# EAGLE design cap_sensor (EAGLE 7.7.0)
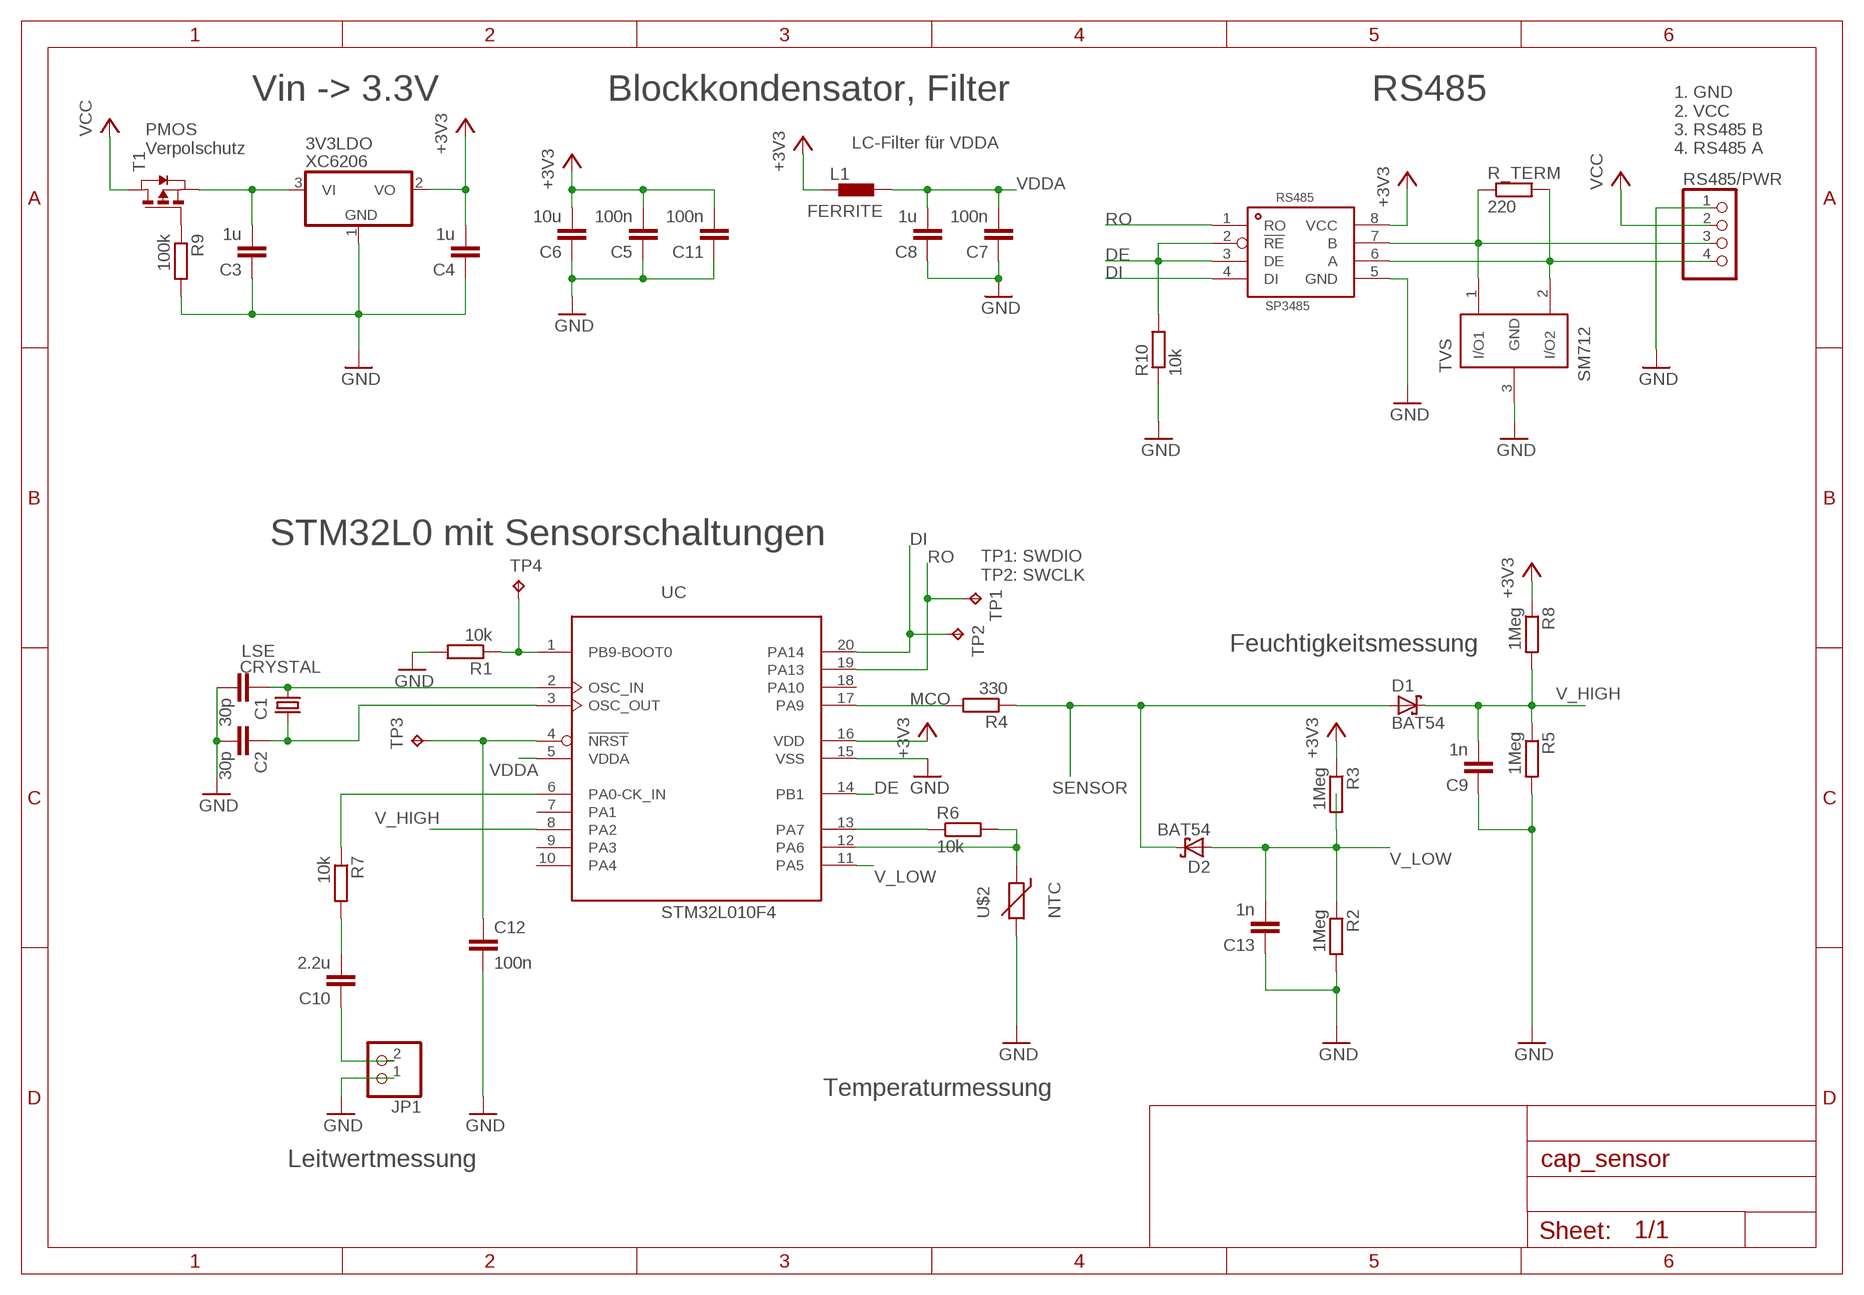
[diagram p0: schematic, sheet 1]

## Parts
3V3LDO  XC6206  [SOT23-3]
C1  30p  C-EUC0603  [C0603]
C2  30p  C-EUC0603  [C0603]
C3  1u  C-EUC0603  [C0603]
C4  1u  C-EUC0603  [C0603]
C5  100n  C-EUC0603  [C0603]
C6  10u  C-EUC0603  [C0603]
C7  100n  C-EUC0603  [C0603]
C8  1u  C-EUC0603  [C0603]
C9  1n  C-EUC0603  [C0603]
C10  2.2u  C-EUC0603  [C0603]
C11  100n  C-EUC0603  [C0603]
C12  100n  C-EUC0603  [C0603]
C13  1n  C-EUC0603  [C0603]
D1  BAT54  [SOT23]
D2  BAT54  [SOT23]
JP1  PINHD-1X2  [1X02]
L1  FERRITE  [R0603]
LSE  CRYSTAL  [CRYSTAL-3.2X1.5]
R1  10k  R-EU_R0603  [R0603]
R2  1Meg  R-EU_R0603  [R0603]
R3  1Meg  R-EU_R0603  [R0603]
R4  330  R-EU_R0603  [R0603]
R5  1Meg  R-EU_R0603  [R0603]
R6  10k  R-EU_R0603  [R0603]
R7  10k  R-EU_R0603  [R0603]
R8  1Meg  R-EU_R0603  [R0603]
R9  100k  R-EU_R0603  [R0603]
R10  10k  R-EU_R0603  [R0603]
R_TERM  220  R-EU_R0603  [R0603]
RS485  SP3485  [NSOIC8]
RS485/PWR  PINHD-1X4  [1X04]
T1  PMOSSOT23  [SOT-23]
TP1  TPTP12R  [TP12R]
TP2  TPTP12R  [TP12R]
TP3  TPTP12R  [TP12R]
TP4  TPTP12R  [TP12R]
TVS  SM712  [SOT23-3]
U$2  NTC  [R0603]
UC  STM32L010F4  [TSSOP20-I]

## Nets
+3V3: 3V3LDO.2(VO) C4.2 C5.2 C6.2 C11.2 L1.1 R3.1 R8.1 RS485.8(VCC) UC.16(VDD)
DE: R10.2 RS485.2(!RE) RS485.3(DE) UC.14(PB1)
DI: RS485.4(DI) TP2.TP UC.20(PA14)
GND: 3V3LDO.1(GND) C1.2 C2.2 C3.1 C4.1 C5.1 C6.1 C7.1 C8.1 C9.1 C11.1 C12.2 C13.1 JP1.1 R1.2 R2.2 R5.2 R9.2 R10.1 RS485.5(GND) RS485/PWR.1 TVS.3(GND) U$2.2 UC.15(VSS)
MCO: R4.2 UC.17(PA9)
N$1: 3V3LDO.3(VI) C3.2 T1.2(S)
N$2: R1.1 TP4.TP UC.1(PB9-BOOT0)
N$3: R6.1 UC.13(PA7)
N$4: C10.1 JP1.2
N$5: C10.2 R7.2
N$6: R6.2 U$2.1 UC.12(PA6)
N$7: C12.1 TP3.TP UC.4(!NRST)
N$8: C1.1 LSE.1 UC.2(OSC_IN)
N$9: C2.1 LSE.2 UC.3(OSC_OUT)
N$10: R9.1 T1.3(G)
N$14: R_TERM.1 RS485.7(B) RS485/PWR.3 TVS.1(I/O1)
N$15: R_TERM.2 RS485.6(A) RS485/PWR.4 TVS.2(I/O2)
RO: RS485.1(RO) TP1.TP UC.19(PA13)
SENS_RES: R7.1 UC.6(PA0-CK_IN)
SENSOR: D1.1(A) D2.3(C) R4.1
V_HIGH: C9.2 D1.3(C) R5.1 R8.2 UC.8(PA2)
V_LOW: C13.2 D2.1(A) R2.1 R3.2 UC.11(PA5)
VCC: RS485/PWR.2 T1.1(D)
VDDA: C7.2 C8.2 L1.2 UC.5(VDDA)
Unconnected: UC.7(PA1) UC.9(PA3) UC.10(PA4) UC.18(PA10)

## Notes on the sheet
- Vin -> 3.3V | Blockkondensator, Filter | RS485
- LC-Filter für VDDA
- PMOS
  Verpolschutz
- 1. GND
  2. VCC
  3. RS485 B
  4. RS485 A
- STM32L0 mit Sensorschaltungen
- TP1: SWDIO
  TP2: SWCLK
- Feuchtigkeitsmessung
- Temperaturmessung
- Leitwertmessung

## Library data of the parts
3V3LDO = misc:XC6206
C1-C13 = rcl:C-EU: CAPACITOR, European symbol
D1 D2 = diode:BAT54: Schottky Diodes Source: Fairchild .. BAT54.pdf
JP1 = pinhead:PINHD-1X2: PIN HEADER
L1 = misc:FERRITE
LSE = misc:CRYSTAL
R1-R10 R_TERM = rcl:R-EU_: RESISTOR, European symbol
RS485 = misc:SP3485
RS485/PWR = pinhead:PINHD-1X4: PIN HEADER
T1 = zetex:PMOSSOT23: MOS FET; OC_FARNELL: unknown; OC_NEWARK: unknown
TP1-TP4 = testpad:TP: Test pad
TVS = misc:SM712
U$2 = misc:NTC
UC = micro-stm_v3:STM32L010F4

## Board
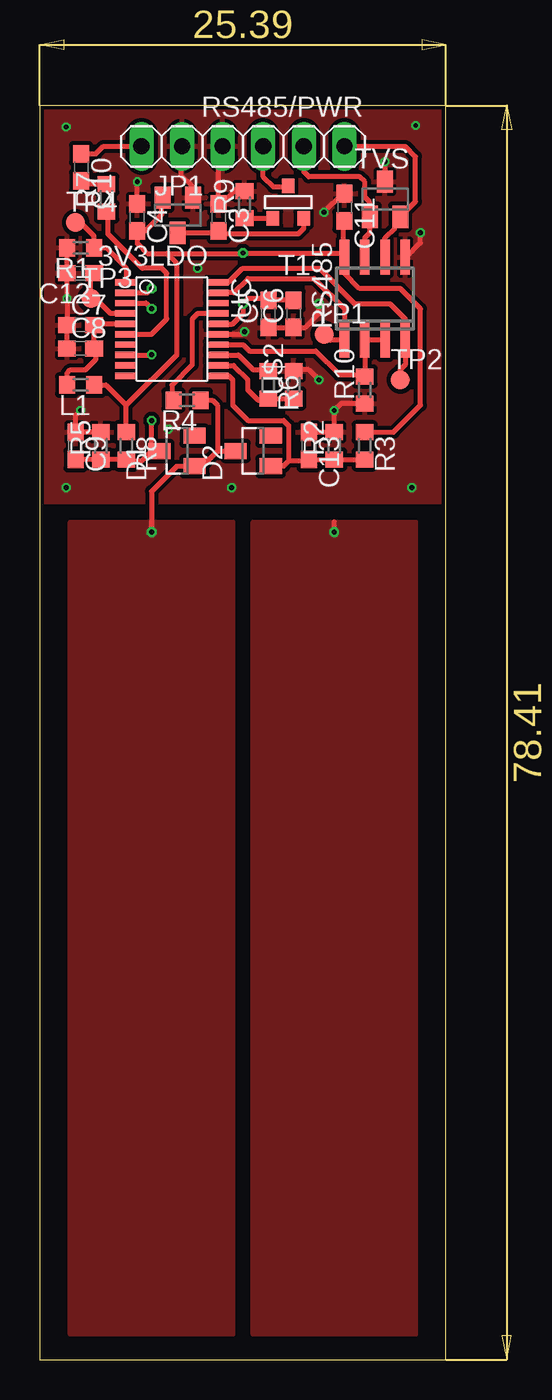
[diagram p1: board, top side]
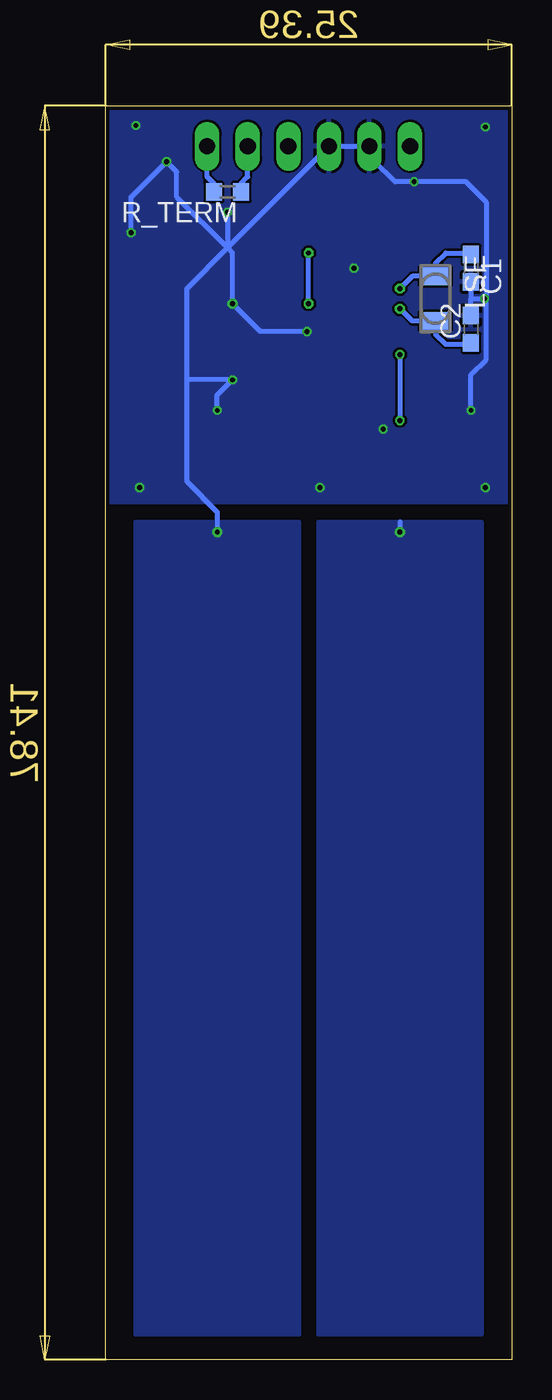
[diagram p2: board, bottom side, seen from below]

Size 25.39 x 78.41 mm. Coordinates in mm from the lower left corner, seen from the top.
Outline: 0,78.41 0,0 25.39,0 25.39,78.41 0,78.41
Copper layers (1*16): Top 0.018mm / dielectric 1.55mm / Bottom 0.018mm
Design rules "eC_2Layer_PClass6_BaseCopperO18_eCDefault": minimum track width 0.15mm, minimum drill 0.35mm, track to track 0.15mm, track to pad 0.15mm, pad to pad 0.15mm, via to via 0.15mm, smd to smd 0mil, copper to edge 0.25mm, drill to drill 0.35mm, minimum pad ring 0.175mm, minimum via ring 0.125mm, stop-mask expansion 0mil, vias tented up to drill 0.45mm, thermal gap 0.2mm

### Footprints (pad centres in the part's own frame; a part is rotated, then mirrored left to right if it is on the bottom)
SOT23-3 = smd 1 x 1.4: 1 -0.95,-0.6; 2 0.95,-0.6; 3 0,1.6
C0603 = smd 1.1 x 1: 1 -0.85,0; 2 0.85,0
SOT23 = smd 1 x 1.4: 1 -0.95,-1.1; 2 0.95,-1.1; 3 0,1.1
1X02 = drill 1.016 long: 1 -1.27,0; 2 1.27,0
R0603 = smd 1 x 1.1: 1 -0.85,0; 2 0.85,0
CRYSTAL-3.2X1.5 = smd 1.1 x 1.9: 1 -1.4,0; 2 1.4,0
NSOIC8 = smd 0.6 x 2.2: 1 -1.905,-2.6; 2 -0.635,-2.6; 3 0.635,-2.6; 4 1.905,-2.6; 5 1.905,2.6; 6 0.635,2.6; 7 -0.635,2.6; 8 -1.905,2.6
1X04 = drill 1.016 long: 1 -3.81,0; 2 -1.27,0; 3 1.27,0; 4 3.81,0
SOT-23 = smd 0.787 x 0.889: 1 0.025,-1.016; 2 -0.94,1.016; 3 0.991,1.016
TP12R = smd 1.2 x 1.2: TP 0,0
TSSOP20-I = smd 0.4 x 1.35: 1 -2.925,-2.875; 2 -2.275,-2.875; 3 -1.625,-2.875; 4 -0.975,-2.875; 5 -0.325,-2.875; 6 0.325,-2.875; 7 0.975,-2.875; 8 1.625,-2.875; 9 2.275,-2.875; 10 2.925,-2.875; 11 2.925,2.875; 12 2.275,2.875; 13 1.625,2.875; 14 0.975,2.875; 15 0.325,2.875; 16 -0.325,2.875; 17 -0.975,2.875; 18 -1.625,2.875; 19 -2.275,2.875; 20 -2.925,2.875

### Placement (x,y rotation side)
3V3LDO  8.62,72.06 180 top
C1  2.54,68.25 270 bottom
C2  2.54,64.44 90 bottom
C3  11.18,71.42 270 top
C4  6.07,71.42 270 top
C5  14.29,65.39 90 top
C6  15.88,65.39 90 top
C7  2.54,64.69 0 top
C8  2.54,63.23 0 top
C9  2.22,57.14 270 top
C10  2.58,74.55 270 top
C11  19.05,72.06 270 top
C12  2.54,67.93 180 top
C13  16.83,57.14 270 top
D1  8.57,56.82 90 top
D2  13.34,56.82 90 top
JP1  7.62,75.87 180 top
L1  2.54,60.95 180 top
LSE  4.76,66.34 270 bottom
R1  2.54,69.52 180 top
R2  18.41,57.14 90 top
R3  20.32,57.14 270 top
R4  9.21,60 180 top
R5  3.81,57.14 90 top
R6  14.29,60.95 270 top
R7  4.17,72.64 90 top
R8  5.4,57.14 270 top
R9  12.8,72.21 90 top
R10  20.32,60.63 90 top
R_TERM  17.78,73.01 180 bottom
RS485  20.95,66.34 0 top
RS485/PWR  15.24,75.87 0 top
T1  15.56,72.38 180 top
TP1  17.78,64.12 0 top
TP2  22.54,61.27 0 top
TP3  3.17,66.34 0 top
TP4  2.22,71.11 0 top
TVS  21.59,72.06 0 top
U$2  15.88,60.95 90 top
UC  8.26,64.44 270 top

### Tracks (layer width: path | path; a pad name or v marks a point on that pad's centre or on a via)
+3V3  (via drill 0.3 pad 0.61)
  Top 0.305: 5.4,59.68 8.57,62.85 8.57,68.52 7.92,69.16 | 13.97,66.34 14.19,66.34 C5.2 C6.2 | 14.07,66.24 13.97,66.34 | 13.97,66.34 13.02,66.34 v12.7,66.03 12.7,65.41 12.06,64.77 UC.16 | R8.1 5.4,59.68 | L1.1 4.13,60.95 5.4,59.68 | RS485.8 19.05,67.93 20,66.98 22.54,66.98 23.81,65.71 23.81,59.68 22.12,57.99 R3.1 | 18.95,71.11 18.95,69.05 RS485.8 | RS485.8 19.05,69.2 | 3V3LDO.2 7.62,72.61 7.62,71.6 6.59,70.58 C4.2 6.1,70.55 6.1,69.77 6.71,69.16 7.92,69.16 | 12.69,69.19 v12.7,69.2 | 19,68.9 RS485.8 | v12.7,69.2 12.66,69.16 7.92,69.16 | v12.7,69.2 18.79,69.2 RS485.8
  Top 0.406: 18.95,71.11 19.05,71.11 C11.2
  Bottom 0.305: v12.7,66.03 v12.7,69.2
DE
  Top 0.305: RS485.3 RS485.2 R10.2 20.22,61.58 18.73,61.58 17.25,63.07 13.11,63.07 12.71,63.47 UC.14
DI
  Top 0.305: TP2.TP 22.54,61.9 22.86,62.22 RS485.4 22.86,65.08 21.91,66.03 19.68,66.03 17.48,68.24 12.69,68.24 11.81,67.36 UC.20
GND  (via drill 0.3, 0.3 pad 0.61)
  Top 0.305: 8.89,75.23 JP1.1 8.84,75.82 8.84,74.04 9.57,73.31 3V3LDO.1 | C13.1 R2.2 v18.41,59.36 18.84,59.78 R10.1 | v18.41,51.74 18.41,52.38 | 14.19,64.44 C5.1 C6.1 16.61,64.54 17.46,65.39 v17.46,66.03 | R5.2 C9.1 2.22,59.04 v2.54,59.36 | R1.2 C12.2 v1.69,66.34 C7.1 C8.1 | 19.05,73.01 18.89,72.85 v17.78,71.74 | v21.59,74.92 TVS.3 | RS485.5 22.92,68.95 23.81,69.84 v23.81,70.47 | U$2.2 15.98,61.9 16.83,61.9 v17.46,61.27 | C4.1 6.07,73.62 v6.1,73.65 | R9.2 12.74,73.13 12.19,73.13 11.34,72.28 C3.1 11.18,75.62 RS485/PWR.1 | UC.15 12.63,64.11 v12.8,64.29
  Top 0.406: C11.1 18.89,72.91 18.89,72.85
  Bottom 0.305: 20.32,61.27 20.32,54.91 18.41,53.01 v18.41,51.74 18.41,52.38 | 20.32,61.27 20.32,66.98 17.78,69.52 | 17.78,69.52 RS485/PWR.1 JP1.1 8.57,75.55 8.57,74.92 7.3,73.65 v6.1,73.65 2.86,73.65 1.59,72.38 1.59,66.45 v1.69,66.34 | C2.2 2.54,66.34 | 17.78,69.52 20.95,72.7 20.95,74.28 v21.59,74.92 23.81,72.7 v23.81,70.47 | v17.78,71.74 17.78,69.52 | 17.78,69.52 17.46,69.2 v17.46,66.03 15.72,64.29 v12.8,64.29 | C1.2 2.54,66.34 | 2.54,66.34 v1.69,66.34 | v2.54,59.36 2.54,61.58 1.59,62.54 1.59,66.24 v1.69,66.34 | 20.32,61.27 v17.46,61.27 18.41,60.31 v18.41,59.36
  other vias: 1.63,77.08 23.27,54.53 8.04,58.19 12,54.53 1.63,54.53 23.51,77.18 9.86,68.24
  pour Top (isolate 0.254): 13.34,52.38 23.5,52.38 23.5,1.57 13.34,1.57
  pour Bottom (isolate 0.254): 23.5,52.38 13.34,52.38 13.34,1.57 23.5,1.57
  pour Bottom: 0,78.41 25.4,78.41 25.4,53.65 0,53.65
  pour Top (isolate 0.254): 0,78.41 0,53.65 25.4,53.65 25.4,78.41
MCO
  Top 0.305: UC.17 9.87,65.42 9.53,65.08 9.53,62.22 8.26,60.95 8.26,60.1 R4.2
N$1
  Top 0.305: 3V3LDO.3 11.06,70.46 C3.2 11.37,70.38 16.15,70.38 16.5,70.73 T1.2
N$2
  Top 0.305: UC.1 5.4,67.38 5.4,68.25 4.13,69.52 R1.1 3.39,70.26 2.54,71.11 TP4.TP
N$3
  Top 0.305: UC.13 12.42,62.82 13.34,61.9 14.19,61.9 R6.1
N$4
  Top 0.305: C10.1 3.49,75.4 3.96,75.87 JP1.2
N$5
  Top 0.305: 2.48,73.49 C10.2 2.78,73.49 R7.2
N$6
  Top 0.305: UC.12 12.12,62.16 13.02,61.27 13.02,60.63 13.65,60 14.19,60 14.19,60.1 R6.2 U$2.1
N$7
  Top 0.305: UC.4 4.42,65.42 3.81,66.03 3.49,66.03 TP3.TP 3.17,67.72 C12.1
N$8  (via drill 0.3 pad 0.61)
  Top 0.305: UC.2 6.72,66.72 v6.99,66.98
  Bottom 0.305: v6.99,66.98 6.22,67.75 LSE.1 4.76,68.57 4.13,69.2 2.64,69.2 C1.1
N$9  (via drill 0.3 pad 0.61)
  Top 0.305: UC.3 6.63,66.06 v6.99,65.71
  Bottom 0.305: v6.99,65.71 6.22,64.95 LSE.2 4.76,64.12 4.13,63.49 2.64,63.49 C2.1
N$10
  Top 0.305: R9.1 T1.3
N$14
  Top 0.305: 20.64,71.14 TVS.1 | 20.95,71.46 TVS.1 | RS485/PWR.3 16.51,74.28 16.83,73.97 20,73.97 20.32,73.65 20.32,72.7 20.64,72.38 TVS.1 | RS485.7 20.32,70.16 20.64,70.47 TVS.1
  Bottom 0.305: R_TERM.1 16.93,73.55 16.51,73.97 RS485/PWR.3
N$15
  Top 0.305: TVS.2 22.86,71.11 | 22.54,71.14 TVS.2 | TVS.2 | TVS.2 23.5,72.42 23.5,75.23 22.86,75.87 RS485/PWR.4 | RS485.6 21.59,70.16 22.23,70.79 22.23,71.14 TVS.2
  Bottom 0.305: R_TERM.2 18.63,73.55 19.05,73.97 RS485/PWR.4
RO
  Top 0.305: TP1.TP 18.16,63.75 RS485.1 19.05,65.71 17.16,67.6 13.01,67.6 12.12,66.72 UC.19
SENS_RES
  Top 0.305: UC.6 6.98,64.11 7.94,65.08 7.94,67.93 7.62,68.25 6.4,68.25 4.27,70.38 4.27,71.69 R7.1
SENSOR  (via drill 0.3 pad 0.61)
  Top 0.305: R4.1 10.79,60 11.11,59.68 11.11,56.82 | 11.11,56.82 10.16,55.87 9.84,55.87 | 11.11,56.82 D2.3 | 9.21,55.87 D1.1 | 6.99,52.38 v6.99,51.74 6.99,54.28 8.57,55.87 9.21,55.87 | 9.21,55.87 9.53,55.87 | 9.53,55.87 D1.1 | 8.57,55.87 9.21,55.87 | 9.21,55.87 9.53,56.19 | 10.16,55.55 9.53,56.19 | 10.16,56.19 10.16,55.55 | 10.16,55.55 9.53,55.55 | 9.53,56.19 9.53,55.87 | 9.53,55.87 9.53,55.55 | D1.1 9.84,55.87 | 9.84,55.87 10.16,56.19 | 10.16,56.19 9.53,56.19 | 9.53,56.19 9.21,56.19 9.21,55.87 | 9.53,55.55 9.21,55.87
  Bottom 0.305: 6.99,52.38 v6.99,51.74
  pour Top (isolate 0.254): 1.91,52.38 12.06,52.38 12.06,1.57 1.91,1.57
  pour Bottom (isolate 0.254): 12.06,52.38 1.91,52.38 1.91,1.57 12.06,1.57
V_HIGH  (via drill 0.3)
  Top 0.305: C9.2 R5.1 R8.2 5.5,56.19 6.35,56.19 6.99,56.82 v6.99,58.73 | UC.8 6.95,62.82 v6.99,62.85
  Top 0.406: 6.99,56.82 D1.3
  Bottom 0.305: v6.99,62.85 v6.99,58.73
V_LOW
  Top 0.305: 20.21,56.29 R3.2 R2.1 C13.2 16.73,56.19 15.56,56.19 | 15.56,56.19 15.56,58.41 15.24,58.73 13.02,58.73 12.06,59.68 12.06,61.27 11.81,61.52 UC.11 | 15.56,56.19 15.24,55.87 D2.1
  Top 0.406: D2.1
VCC
  Top 0.305: T1.1 15.47,73.33 14.61,73.33 13.97,73.97 RS485/PWR.2
VDDA
  Top 0.305: L1.2 1.69,61.69 1.91,61.9 2.86,61.9 3.49,62.54 3.49,63.23 C8.2 C7.2 3.39,64.77 UC.5